# Altium schematic sheet 3.SchDoc
size 420 x 297 mm
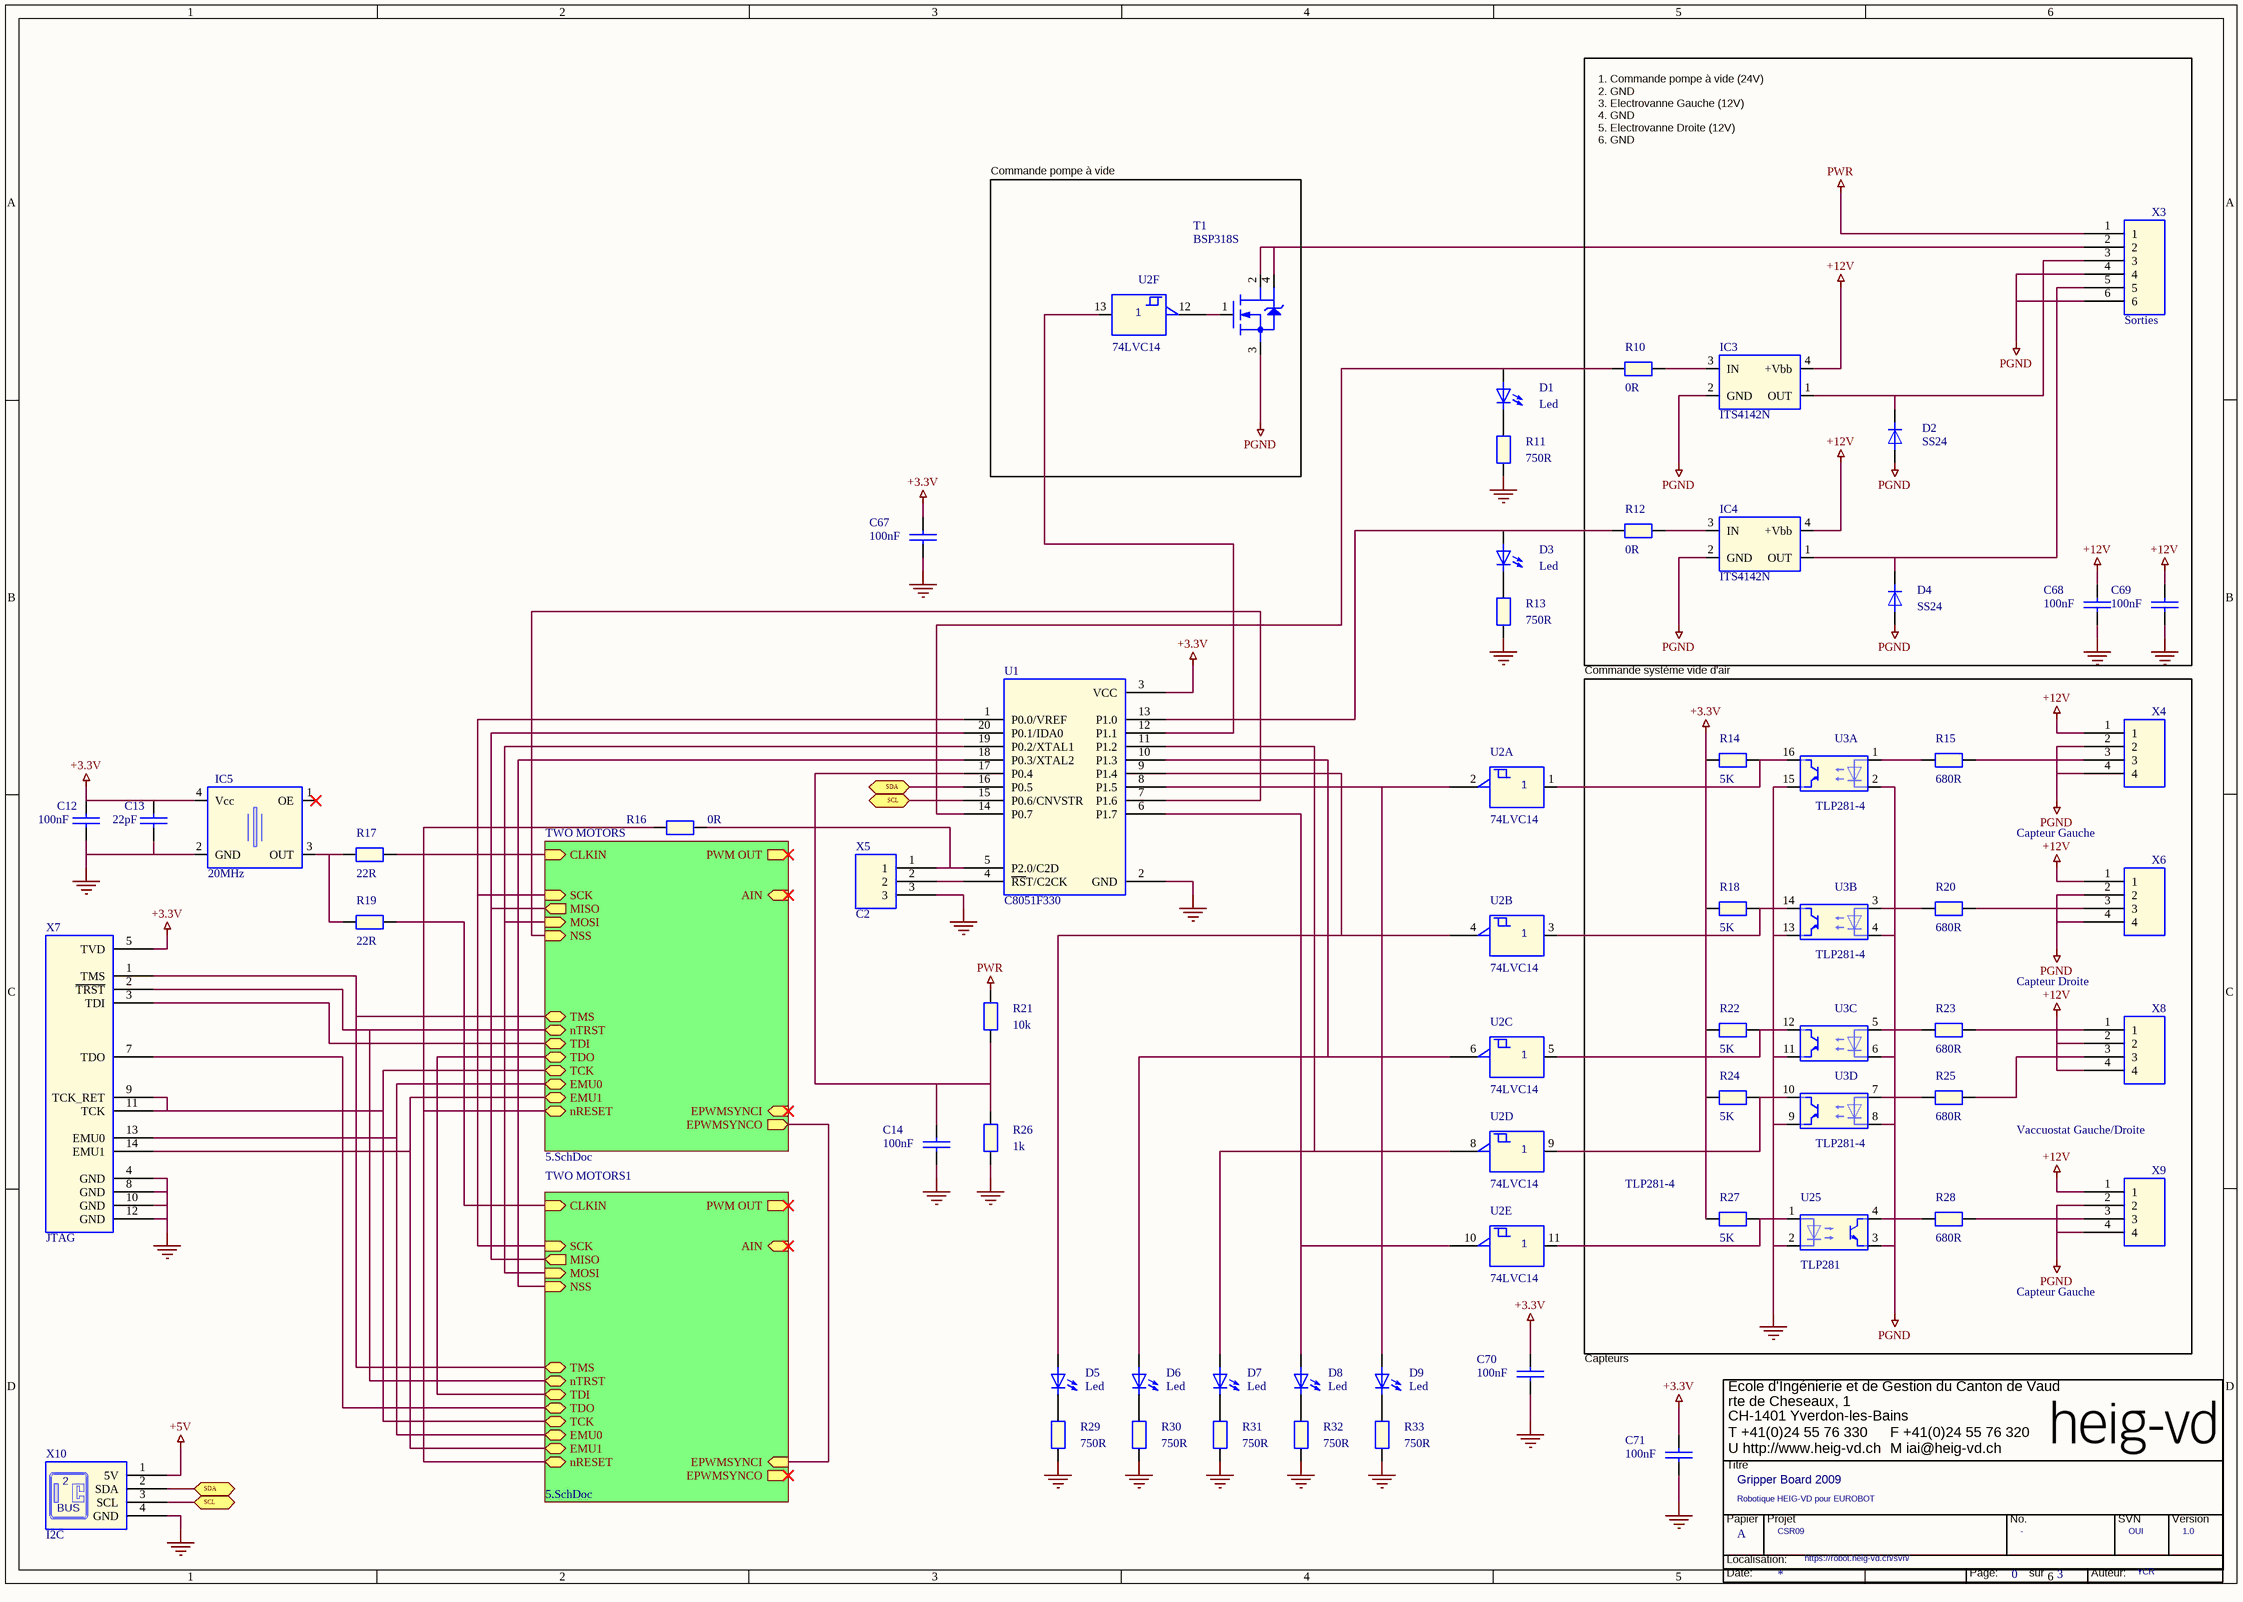
[diagram p0: 3.SchDoc]

## Parts
(Parts that share a designator on the sheet are numbered #1, #2 ... from top to bottom, then left to right.)
*  RevCode: 1.0  Title: Gripper Board 2009  Page Size: A  Page Number: 0  Page Count: 3  Projet: CSR09  Subtitle: Robotique HEIG-VD pour EUROBOT  Author: YCR  SVN: OUI  (hidden comment: TitleBlock HEIG-VD)  (graphical)
C12  100nF  [SM/C_0805]
C13  22pF  [SM/C_0805]
C14  100nF  [SM/C_0805]
C67  100nF  [SM/C_0805]
C68  100nF  [SM/C_0805]
C69  100nF  [SM/C_0805]
C70  100nF  [SM/C_0805]
C71  100nF  [SM/C_0805]
D1  Led  [LED 5]
D2  SS24  [HEIG/SM/DO214]
D3  Led  [LED 5]
D4  SS24  [HEIG/SM/DO214]
D5  Led  [LED 5]
D6  Led  [LED 5]
D7  Led  [LED 5]
D8  Led  [LED 5]
D9  Led  [LED 5]
IC3  ITS4142N  [HEIG/SM/SOT223]
IC4  ITS4142N  [HEIG/SM/SOT223]
IC5  20MHz  [HEIG/OSC/SPX0/SG-310]
R10  0R  [R400]
R11  750R  [R400]
R12  0R  [R400]
R13  750R  [R400]
R14  5K  [R400]
R15  680R  [R400]
R16  0R  [R400]
R17  22R  [R400]
R18  5K  [R400]
R19  22R  [R400]
R20  680R  [R400]
R21  10k  [R400]
R22  5K  [R400]
R23  680R  [R400]
R24  5K  [R400]
R25  680R  [R400]
R26  1k  [R400]
R27  5K  [R400]
R28  680R  [R400]
R29  750R  [R400]
R30  750R  [R400]
R31  750R  [R400]
R32  750R  [R400]
R33  750R  [R400]
T1  BSP318S  [HEIG/SM/SOT223]
U1  C8051F330  [F300]
U2#1  74LVC14  [HEIG/SM/SOIC14]  (part F of 6)
U2#2  74LVC14  [HEIG/SM/SOIC14]  (part A of 6)
U2#3  74LVC14  [HEIG/SM/SOIC14]  (part B of 6)
U2#4  74LVC14  [HEIG/SM/SOIC14]  (part C of 6)
U2#5  74LVC14  [HEIG/SM/SOIC14]  (part D of 6)
U2#6  74LVC14  [HEIG/SM/SOIC14]  (part E of 6)
U3  TLP281-4  [HEIG/SM/SOIC16/7.0M]  (parts A,B,C,D of 4)
U25  TLP281  [HEIG/SM/SOIC04/7.0M]
X3  Sorties  [HEIG/WAGO/733-336]
X4  Capteur Gauche  [HEIG/WAGO/733-334]
X5  C2  [HEIG/CON/INLINE03]
X6  Capteur Droite  [HEIG/WAGO/733-334]
X7  JTAG  [HEIG/CON/INLINE14/2]
X8  Vaccuostat Gauche/Droite  [HEIG/WAGO/733-334]
X9  Capteur Gauche  [HEIG/WAGO/733-334]
X10  I2C  [HEIG/CON/MICROMATCH/4F]

## Blocks framed on the sheet
Commande pompe à vide: T1 U2#1
Commande système vide d'air: R14 R15 R18 R20 R22-R25 R27 R28 U3 U25 X4 X6 X8 X9

## Sub-sheets
TWO MOTORS = 5.SchDoc: MOSI (in), NSS (in), SCK (in), MISO (out), TMS (bidir), nTRST (bidir), TDI (bidir), TDO (bidir), TCK (bidir), EMU0 (bidir), EMU1 (bidir), nRESET (bidir), CLKIN (in), EPWMSYNCO (out), EPWMSYNCI (in), AIN (in), PWM OUT (out)  | ReuseAnnotated: YES; U__2_PartReference: U22; R494_PartReference: R67; C__7_PartReference: C53; U__3_PartReference: IC8; WARNING1_PartReference: WARNING3; C__8_PartReference: C54; C__2_PartReference: C55; U__4_PartReference: IC8; U7_1_PartReference: U7; R__11_PartReference: R68; D__PartReference: D12; U24_PartReference: U7; C__18_PartReference: C56; C__PartReference: C57; Q__1_PartReference: Q3; C__1_PartReference: C58; DRIVE_X__PartReference: X15; DRIVE_C__15_PartReference: C47; DRIVE_U__9_PartReference: U19; DRIVE_C__13_PartReference: C48; DRIVE_C__16_PartReference: C49; DRIVE_R__10_PartReference: R87; DRIVE_C__17_PartReference: C51; DRIVE_C__20_PartReference: C77; DRIVE_R__6_PartReference: R62; DRIVE_R__9_PartReference: R86; DRIVE_U6_PartReference: U20; DRIVE_R__4_PartReference: R63; DRIVE_C__14_PartReference: C52; DRIVE_R__8_PartReference: R64; DRIVE_R__7_PartReference: R65; DRIVE_U__8_PartReference: U21; DRIVE_R__5_PartReference: R66; DRIVE_TitleBlock_3_Page_Number: 0; R497_PartReference: R69; Q__PartReference: Q4; R__PartReference: R70; X29_PartReference: X16; R493_PartReference: R71; C__4_PartReference: C59; C__3_PartReference: C60; U__5_PartReference: IC8; C__10_PartReference: C61; U__1_PartReference: IC8; U__6_PartReference: IC8; R495_PartReference: R72; C__19_PartReference: C79; D__1_PartReference: D13; R499_PartReference: R73; U7_2_PartReference: U7; C__5_PartReference: C62; C__6_PartReference: C63; U7_PartReference: U7; R496_PartReference: R74; C__11_PartReference: C64; R__1_PartReference: R75; U__7_PartReference: IC8; C__12_PartReference: C65; R492_PartReference: R76; DRIVE1_X__PartReference: X14; DRIVE1_C__15_PartReference: C41; DRIVE1_U__9_PartReference: U16; DRIVE1_C__13_PartReference: C42; DRIVE1_C__16_PartReference: C43; DRIVE1_R__10_PartReference: R85; DRIVE1_C__17_PartReference: C45; DRIVE1_C__20_PartReference: C76; DRIVE1_R__6_PartReference: R57; DRIVE1_R__9_PartReference: R84; DRIVE1_U6_PartReference: U17; DRIVE1_R__4_PartReference: R58; DRIVE1_C__14_PartReference: C46; DRIVE1_R__8_PartReference: R59; DRIVE1_R__7_PartReference: R60; DRIVE1_U__8_PartReference: U18; DRIVE1_R__5_PartReference: R61; DRIVE1_TitleBlock_3_Page_Number: 0; R__2_PartReference: R77; C__21_PartReference: C78; R__3_PartReference: R78; C__9_PartReference: C66; U__PartReference: U22; R498_PartReference: R79; TitleBlock_Page_Number: 0
TWO MOTORS1 = 5.SchDoc: MOSI (in), NSS (in), SCK (in), MISO (out), TMS (bidir), nTRST (bidir), TDI (bidir), TDO (bidir), TCK (bidir), EMU0 (bidir), EMU1 (bidir), nRESET (bidir), CLKIN (in), EPWMSYNCI (in), EPWMSYNCO (out), AIN (in), PWM OUT (out)  | ReuseAnnotated: YES; U__2_PartReference: U14; R494_PartReference: R53; C__7_PartReference: C34; U__3_PartReference: IC7; WARNING1_PartReference: WARNING2; C__8_PartReference: C27; C__2_PartReference: C33; U__4_PartReference: IC7; U7_1_PartReference: U24; R__11_PartReference: R45; D__PartReference: D10; U24_PartReference: U24; C__18_PartReference: C28; C__PartReference: C36; Q__1_PartReference: Q2; C__1_PartReference: C37; DRIVE_X__PartReference: X12; DRIVE_C__15_PartReference: C21; DRIVE_U__9_PartReference: U11; DRIVE_C__13_PartReference: C22; DRIVE_C__16_PartReference: C23; DRIVE_R__10_PartReference: R83; DRIVE_C__17_PartReference: C25; DRIVE_C__20_PartReference: C73; DRIVE_R__6_PartReference: R39; DRIVE_R__9_PartReference: R82; DRIVE_U6_PartReference: U12; DRIVE_R__4_PartReference: R40; DRIVE_C__14_PartReference: C26; DRIVE_R__8_PartReference: R41; DRIVE_R__7_PartReference: R42; DRIVE_U__8_PartReference: U13; DRIVE_R__5_PartReference: R43; DRIVE_TitleBlock_3_Page_Number: 0; R497_PartReference: R47; Q__PartReference: Q1; R__PartReference: R55; X29_PartReference: X13; R493_PartReference: R52; C__4_PartReference: C32; C__3_PartReference: C35; U__5_PartReference: IC7; C__10_PartReference: C39; U__1_PartReference: IC7; U__6_PartReference: IC7; R495_PartReference: R54; C__19_PartReference: C75; D__1_PartReference: D11; R499_PartReference: R49; U7_2_PartReference: U24; C__5_PartReference: C30; C__6_PartReference: C31; U7_PartReference: U24; R496_PartReference: R46; C__11_PartReference: C38; R__1_PartReference: R44; U__7_PartReference: IC7; C__12_PartReference: C29; R492_PartReference: R50; DRIVE1_X__PartReference: X11; DRIVE1_C__15_PartReference: C16; DRIVE1_U__9_PartReference: U9; DRIVE1_C__13_PartReference: C20; DRIVE1_C__16_PartReference: C18; DRIVE1_R__10_PartReference: R81; DRIVE1_C__17_PartReference: C17; DRIVE1_C__20_PartReference: C72; DRIVE1_R__6_PartReference: R35; DRIVE1_R__9_PartReference: R80; DRIVE1_U6_PartReference: U8; DRIVE1_R__4_PartReference: R34; DRIVE1_C__14_PartReference: C15; DRIVE1_R__8_PartReference: R37; DRIVE1_R__7_PartReference: R38; DRIVE1_U__8_PartReference: U10; DRIVE1_R__5_PartReference: R36; DRIVE1_TitleBlock_3_Page_Number: 1; R__2_PartReference: R51; C__21_PartReference: C74; R__3_PartReference: R56; C__9_PartReference: C40; U__PartReference: U14; R498_PartReference: R48; TitleBlock_Page_Number: 1

## Ports
SCL (bidir), SDA (bidir)

## Nets
+3.3V: C12.1 C13.1 C67.1 C70.1 C71.1 IC5.4(Vcc) R14.1 R18.1 R22.1 R24.1 R27.1 U1.3(VCC) X7.5(TVD)
+5V: U2#1.14(+5V) U2#2.14(+5V) U2#3.14(+5V) U2#4.14(+5V) U2#5.14(+5V) U2#6.14(+5V) X10.1(5V)
+12V: C68.1 C69.1 IC3.4(+Vbb) IC4.4(+Vbb) X4.1 X6.1 X8.2 X8.4 X9.1
GND: C12.2 C13.2 C14.2 C67.2 C68.2 C69.2 C70.2 C71.2 IC5.2(GND) R11.1 R13.1 R26.1 R29.1 R30.1 R31.1 R32.1 R33.1 U1.2(GND) U2#1.7(GND) U2#2.7(GND) U2#3.7(GND) U2#4.7(GND) U2#5.7(GND) U2#6.7(GND) U3.9(E) U3.11(E) U3.13(E) U3.15(E) U25.2(C) X5.3 X7.4(GND) X7.8(GND) X7.10(GND) X7.12(GND) X10.4(GND)
PGND: D2.1(a) D4.1(a) IC3.2(GND) IC4.2(GND) T1.3(S) U3.2(C) U3.4(C) U3.6(C) U3.8(C) U25.3(E) X3.4 X3.6 X4.2 X4.4 X6.2 X6.4 X9.2 X9.4
PWR: R21.2 X3.1
SCL: U1.15(P0.6/CNVSTR) X10.3(SCL) ; port SCL
SDA: U1.16(P0.5) X10.2(SDA) ; port SDA
NetC14_1: C14.1 R21.1 R26.2 U1.17(P0.4)
NetD1_1: D1.1 R10.1 U1.14(P0.7)
NetD1_2: D1.2 R11.2
NetD2_2: D2.2(k) IC3.1(OUT) X3.3
NetD3_1: D3.1 R12.1 U1.13(P1.0)
NetD3_2: D3.2 R13.2
NetD4_2: D4.2(k) IC4.1(OUT) X3.5
NetD5_1: D5.1 U1.9(P1.4) U2#3.4(6Y)
NetD5_2: D5.2 R29.2
NetD6_1: D6.1 U1.10(P1.3) U2#4.6(6Y)
NetD6_2: D6.2 R30.2
NetD7_1: D7.1 U1.11(P1.2) U2#5.8(6Y)
NetD7_2: D7.2 R31.2
NetD8_1: D8.1 U1.6(P1.7) U2#6.10(6Y)
NetD8_2: D8.2 R32.2
NetD9_1: D9.1 U1.8(P1.5) U2#2.2(6Y)
NetD9_2: D9.2 R33.2
NetIC3_3: IC3.3(IN) R10.2
NetIC4_3: IC4.3(IN) R12.2
NetIC5_3: IC5.3(OUT) R17.1 R19.1
NetR14_2: R14.2 U2#2.1(6A) U3.16(COL)
NetR15_1: R15.1 U3.1(A)
NetR15_2: R15.2 X4.3
NetR16_1: R16.1 ; sheet TWO MOTORS/nRESET, sheet TWO MOTORS1/nRESET
NetR16_2: R16.2 U1.5(P2.0/C2D) X5.1
NetR17_2: R17.2 ; sheet TWO MOTORS/CLKIN
NetR18_2: R18.2 U2#3.3(6A) U3.14(COL)
NetR19_2: R19.2 ; sheet TWO MOTORS1/CLKIN
NetR20_1: R20.1 U3.3(A)
NetR20_2: R20.2 X6.3
NetR22_2: R22.2 U2#4.5(6A) U3.12(COL)
NetR23_1: R23.1 U3.5(A)
NetR23_2: R23.2 X8.1
NetR24_2: R24.2 U2#5.9(6A) U3.10(COL)
NetR25_1: R25.1 U3.7(A)
NetR25_2: R25.2 X8.3
NetR27_2: R27.2 U2#6.11(6A) U25.1(A)
NetR28_1: R28.1 U25.4(COL)
NetR28_2: R28.2 X9.3
NetT1_1: T1.1(G) U2#1.12(6Y)
NetT1_2: T1.2(D) T1.4(D) X3.2
NetU1_1: U1.1(P0.0/VREF) ; sheet TWO MOTORS/SCK, sheet TWO MOTORS1/SCK
NetU1_4: U1.4(~{RS}T/C2CK) X5.2
NetU1_7: U1.7(P1.6) ; sheet TWO MOTORS/NSS
NetU1_12: U1.12(P1.1) U2#1.13(6A)
NetU1_18: U1.18(P0.3/XTAL2) ; sheet TWO MOTORS1/NSS
NetU1_19: U1.19(P0.2/XTAL1) ; sheet TWO MOTORS/MOSI, sheet TWO MOTORS1/MOSI
NetU1_20: U1.20(P0.1/IDA0) ; sheet TWO MOTORS/MISO, sheet TWO MOTORS1/MISO
NetX7_1: X7.1(TMS) ; sheet TWO MOTORS/TMS, sheet TWO MOTORS1/TMS
NetX7_2: X7.2(~{TRST}) ; sheet TWO MOTORS/nTRST, sheet TWO MOTORS1/nTRST
NetX7_3: X7.3(TDI) ; sheet TWO MOTORS/TDI
NetX7_7: X7.7(TDO) ; sheet TWO MOTORS1/TDO
NetX7_9: X7.9(TCK_RET) X7.11(TCK) ; sheet TWO MOTORS/TCK, sheet TWO MOTORS1/TCK
NetX7_13: X7.13(EMU0) ; sheet TWO MOTORS/EMU0, sheet TWO MOTORS1/EMU0
NetX7_14: X7.14(EMU1) ; sheet TWO MOTORS/EMU1, sheet TWO MOTORS1/EMU1
(unnamed): sheet TWO MOTORS/TDO, sheet TWO MOTORS1/TDI
(unnamed): sheet TWO MOTORS/EPWMSYNCO, sheet TWO MOTORS1/EPWMSYNCI

Not connected (* = marked no-connect by the designer): IC5 1(OE)*

## Notes on the sheet
- 1. Commande pompe à vide (24V)
  2. GND
  3. Electrovanne Gauche (12V)
  4. GND
  5. Electrovanne Droite (12V)
  6. GND
- Capteurs
- (in symbol I2C) BUS
- (in symbol TitleBlock HEIG-VD) Ecole d'Ingénierie et de Gestion du Canton de Vaud; rte de Cheseaux, 1; CH-1401 Yverdon-les-Bains; T +41(0)24 55 76 330; F +41(0)24 55 76 320; U http://www.heig-vd.ch; M iai@heig-vd.ch; Titre; Papier; Projet; No.; SVN; Version; Localisation:; Date:; Page:; sur; Auteur:

## Library data of the parts
* = TitleBlock HEIG-VD: OrgName: Yves Chevallier; OrgAddr1: Ecole d'Ingenierie et du Canton de Vaud; OrgAddr2: route de Cheseaux, 1; OrgAddr3: 1400 Yverdon-les-Bains; Page Create Date: March  8, 1995; No Projet: -; Location: https://robot.heig-vd.ch/svn/; Page Modify Date: *
C12 = C_Dup1: PCB Footprint: HEIG/SM/C_0805; Prix Unitaire: 0.14; Référence: 499-687; Ref. Fab: AVX; Prix: 0.06; Ref. Fabricant: 2238 786 15649; Fabricant: PHYCOMP; Quantité min: 10; Distributor: Farnell; Ref. Distributor: 499-687; Price in €: 0.140; Distributeur: Farnell; Ref. Distributeur: 432210
C13 C14 C67-C71 = C_Dup1: PCB Footprint: HEIG/SM/C_0805; Quantité min: 10; Fabricant: AVX; Ref. Fabricant: 06035A220JAT2A; Prix: 0.098; Référence: 499-687; Prix Unitaire: 0.14; Ref. Distributeur: 498543; Distributeur: Farnell; Ref. Fab: AVX; Price in €: 0.140; Ref. Distributor: 499-687; Distributor: Farnell
D1 = Led: PCB Footprint: HEIG/SM/D_0805; Prix: 0.65; Fabricant: ROHM; Ref. Fabricant: SML-210VTT86; Distributeur: Farnell; Ref. Distributeur: 1685054
D2 D4 = D: PCB Footprint: HEIG/SM/DO214
D3 = Led: PCB Footprint: HEIG/SM/D_0805; Fabricant: ROHM; Ref. Fabricant: SML-210VTT86; Prix: 0.65; Quantité min: 1; Distributeur: Farnell; Ref. Distributeur: 1685054
D5-D9 = Led: PCB Footprint: HEIG/SM/D_0805; Ref. Fabricant: SML-210VTT86; Fabricant: ROHM; Prix: 0.65; Ref. Distributeur: 1685054; Distributeur: Farnell
IC3 IC4 = ITS4142N: Fabricant: INFINEON; Prix: 4.30; PCB Footprint: HEIG/SM/SOT223; Distributeur: Farnell; Ref. Distributeur: 1440816; Ref. Fabricant: ITS4142N
IC5 = Xtal Oscillateur: Tolérance: 100ppm; Quantité min: 1; Voltage: 3.3V; Prix: 5.50; Ref. Fabricant: SG-310 SCF C 20.0MHZ; Fabricant: EPSON TOYOCOM; PCB Footprint: HEIG/OSC/SPX0/SG-310; Ref. Distributeur: 1278064; Distributeur: Farnell
R10-R33 = R_Dup3: PCB Footprint: HEIG/SM/R_0805
T1 = BSP318S: Fabricant: INFINEON; Prix: 0.975; Quantité min: 1; PCB Footprint: HEIG/SM/SOT223; Distributeur: Farnell; Ref. Distributeur: 1214267; Ref. Fabricant: BSP318S
U1 = C8051F330_0: PCB Footprint: HEIG/SM/QFN20; Ref. Fabricant: C8051F330GK; Prix: 5.00; Distributeur: Mouser; Ref. Distributeur: C8051F330GK
U2#1 = 7414-1_6: Ref. Fabricant: SN74LVC14AD; Fabricant: TEXAS INSTRUMENTS; Prix: 0.953; Ref. Distributeur: 1102973; Distributeur: Farnell; PCB Footprint: HEIG/SM/SOIC14
U2#2 = 7414-1_7: Prix: 0.953; Fabricant: TEXAS INSTRUMENTS; Ref. Fabricant: SN74LVC14AD; Distributeur: Farnell; Ref. Distributeur: 1102973; PCB Footprint: HEIG/SM/SOIC14
U2#3 = 7414-1_2: Ref. Fabricant: SN74LVC14AD; Fabricant: TEXAS INSTRUMENTS; Prix: 0.953; Ref. Distributeur: 1102973; Distributeur: Farnell; PCB Footprint: HEIG/SM/SOIC14
U2#4 = 7414-1_3: Ref. Fabricant: SN74LVC14AD; Fabricant: TEXAS INSTRUMENTS; Prix: 0.953; Ref. Distributeur: 1102973; Distributeur: Farnell; PCB Footprint: HEIG/SM/SOIC14
U2#5 = 7414-1_4: Prix: 0.953; Fabricant: TEXAS INSTRUMENTS; Ref. Fabricant: SN74LVC14AD; Distributeur: Farnell; Ref. Distributeur: 1102973; PCB Footprint: HEIG/SM/SOIC14
U2#6 = 7414-1_5: Fabricant: TEXAS INSTRUMENTS; Ref. Fabricant: SN74LVC14AD; Prix: 0.953; Distributeur: Farnell; Ref. Distributeur: 1102973; PCB Footprint: HEIG/SM/SOIC14
X3 = Connecteur 06: PCB Footprint: HEIG/WAGO/733-336
X4 X6 X8 X9 = Connecteur 04: PCB Footprint: HEIG/WAGO/733-334
X5 = Connecteur 03_Dup1: PCB Footprint: HEIG/CON/INLINE03
X7 = CON14_0: COMPHEIGHT: 0.000; MEMORY: NO; COMPGROUP: 0; COMPROT: 180; COMPLOC: [-3462.500,5924.500]; COMPSIDE: TOP; FPLIST: BLKCON.100/VH/TM2OE/W.200/14; DECOUPLER: NO; COMPKEY: NO; COMPLOCKED: NO; COMPFIXED: NO; PCB Footprint: HEIG/CON/INLINE14/2
X10 = I2C: Ref. Fab: TYCO 7-215079-4; Distributor: Farnell; Ref. Distributor: 148507; Price in €: 0.57; PCB Footprint: HEIG/CON/MICROMATCH/4F
U3 = TLP281-4: PCB Footprint: HEIG/SM/SOIC16/7.0M
U25 = TLP281: Fabricant: TLP281; Ref. Distributeur: 1225848; Distributeur: Farnell; PCB Footprint: HEIG/SM/SOIC04/7.0M